# EAGLE schematic pc-001 (EAGLE 9.1.0)
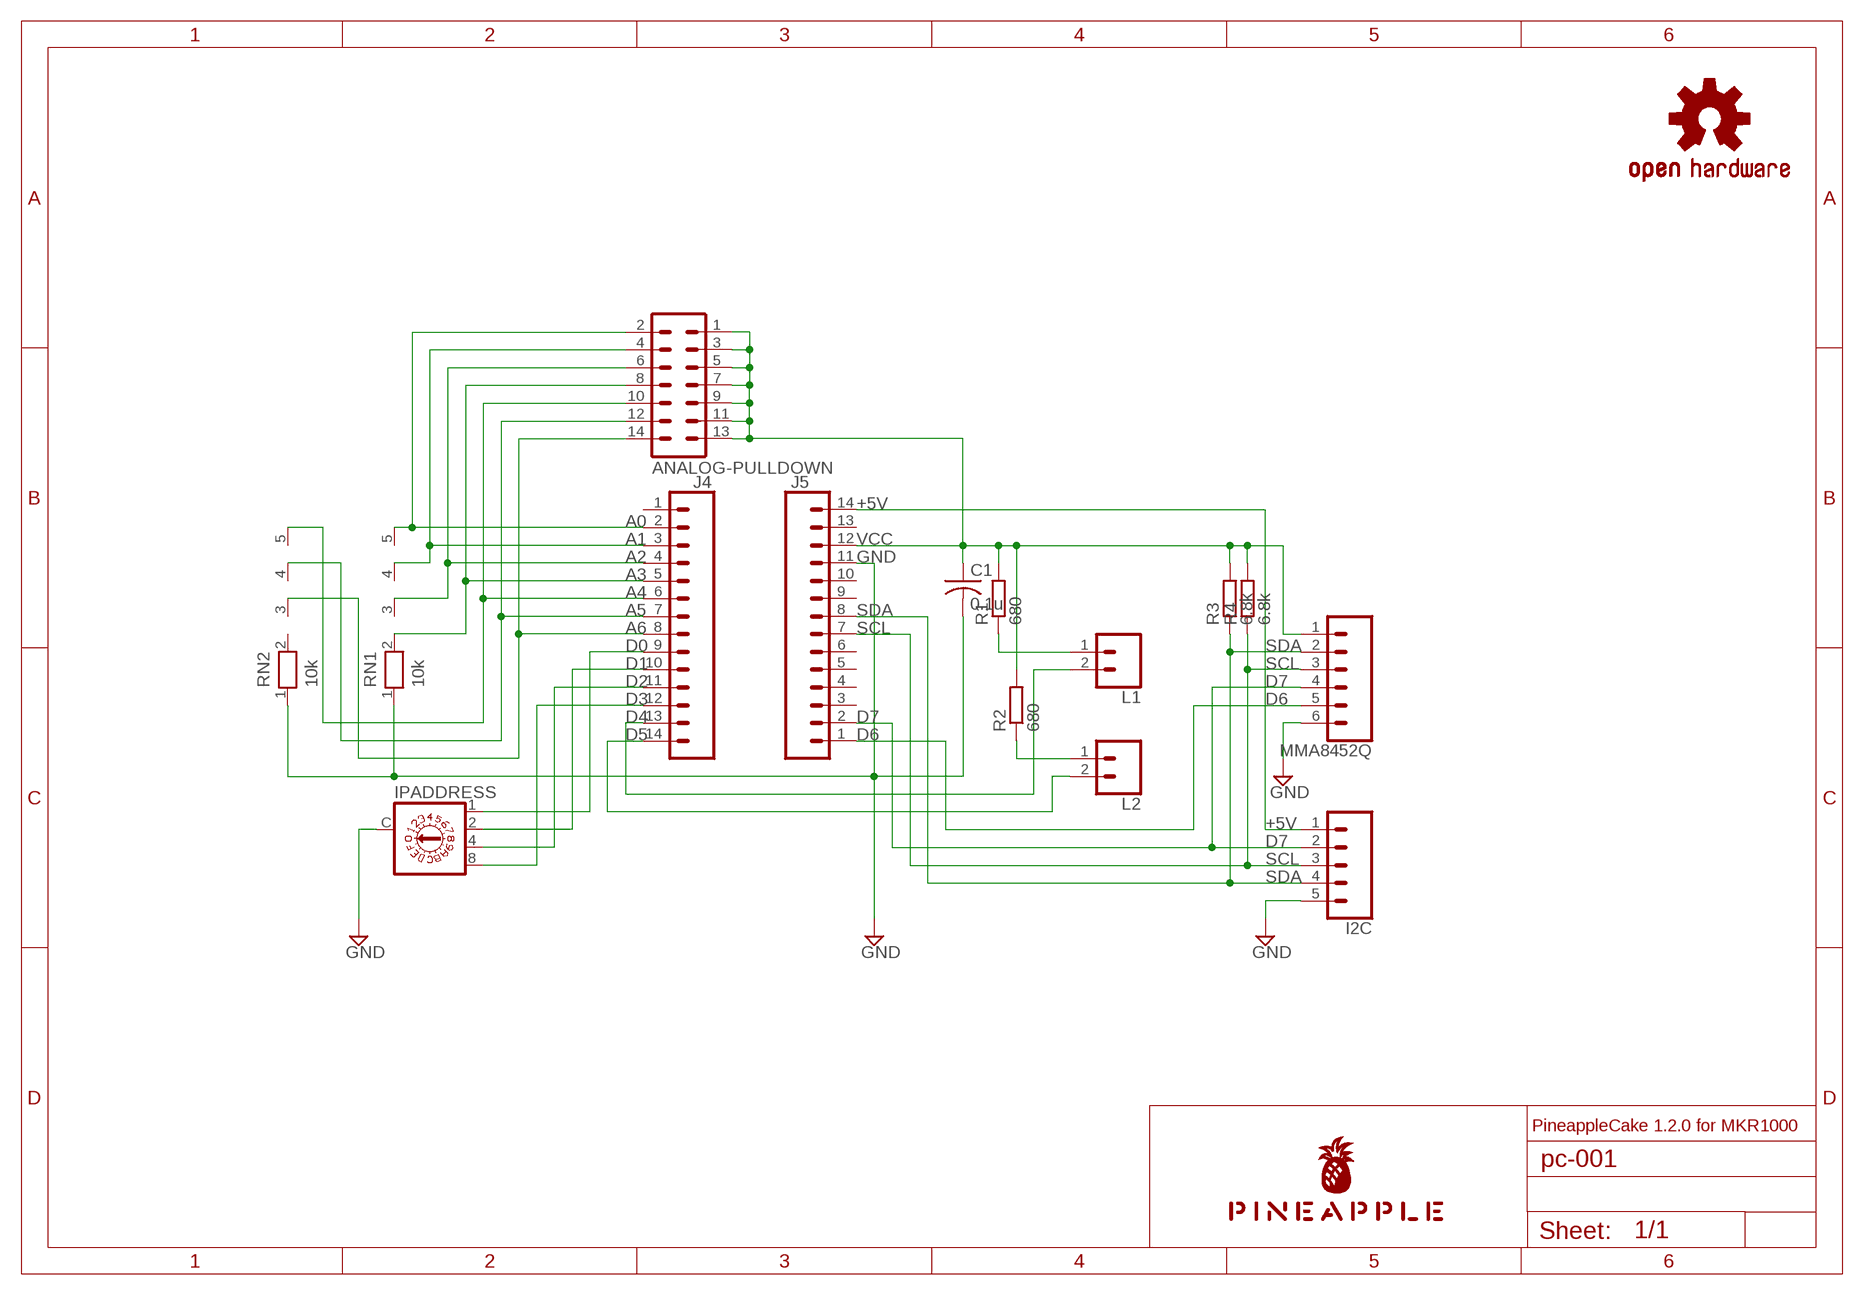
[diagram p0: schematic, sheet 1]

## Parts
ANALOG-PULLDOWN  ML14L  [ML14L]
C1  0.1u  C-US025-025X050  [C025-025X050]
I2C  CONN_05SMD  [1X05_1MM]
IPADDRESS  A1353HEX  [A1353HEX]
J4  DNP  CONN_14  [1X14]
J5  DNP  CONN_14  [1X14]
L1  CONN_02-JST-2-PTH-NO_SILK  [JST-2-PTH-NS]
L2  CONN_02-JST-2-PTH-NO_SILK  [JST-2-PTH-NS]
LOGO1  OSHW-LOGOS-COPPER  [OSHW-LOGO-S_COPPER]
MMA8452Q  CONN_06NO_SILK_FEMALE_PTH  [1X06_NO_SILK]
R1  680  R-EU_0204/5  [0204/5]
R2  680  R-EU_0204/5  [0204/5]
R3  6.8k  R-EU_0204/5  [0204/5]
R4  6.8k  R-EU_0204/5  [0204/5]
RN1  10k  RN04  [RN-5]
RN2  10k  RN04  [RN-5]
U$1  PINEAPPLE450  [PINEAPPLE450]

## Nets
+5V [power]: I2C.1 J5.14
A0: ANALOG-PULLDOWN.2 J4.2 RN1.5
A1: ANALOG-PULLDOWN.4 J4.3 RN1.4
A2: ANALOG-PULLDOWN.6 J4.4 RN1.3
A3: ANALOG-PULLDOWN.8 J4.5 RN1.2
A4: ANALOG-PULLDOWN.10 J4.6 RN2.5
A5: ANALOG-PULLDOWN.12 J4.7 RN2.4
A6: ANALOG-PULLDOWN.14 J4.8 RN2.3
D0: IPADDRESS.1 J4.9
D1: IPADDRESS.2 J4.10
D2: IPADDRESS.4 J4.11
D3: IPADDRESS.8 J4.12
D4: J4.13 L1.2
D5: J4.14 L2.2
D6: J5.1 MMA8452Q.5
D7: I2C.2 J5.2 MMA8452Q.4
GND [gnd]: C1.2 I2C.5 IPADDRESS.C J5.11 MMA8452Q.6 RN1.1 RN2.1
LED1A: L1.1 R1.1
LED2A: L2.1 R2.1
SCL: I2C.3 J5.7 MMA8452Q.3 R4.1
SDA: I2C.4 J5.8 MMA8452Q.2 R3.1
VCC [power]: ANALOG-PULLDOWN.1 ANALOG-PULLDOWN.3 ANALOG-PULLDOWN.5 ANALOG-PULLDOWN.7 ANALOG-PULLDOWN.9 ANALOG-PULLDOWN.11 ANALOG-PULLDOWN.13 C1.1 J5.12 MMA8452Q.1 R1.2 R2.2 R3.2 R4.2
Unconnected: J4.1 J5.3 J5.4 J5.5 J5.6 J5.9 J5.10 J5.13 RN2.2

## Notes on the sheet
- PineappleCake 1.2.0 for MKR1000

## Library data of the parts
ANALOG-PULLDOWN = con-ml:ML14L: HARTING; OC_FARNELL: unknown; OC_NEWARK: unknown
C1 = resistor:C-US: CAPACITOR, American symbol
I2C = SparkFun-Connectors:CONN_05: Multi connection point. Often used as Generic Header-pin footprint for 0.1 inch spaced/style header connections On any of the 0.1 inch spaced packages, you can populate with these: Break Away Headers - Straight <https://www.sparkfun.com/products/116> (PRT-00116) Break Away Male Headers - Right Angle <https://www.sparkfun.com/products/553> (PRT-00553) Female Headers <https://www.sparkfun.com/products/115> (PRT-00115) Break Away Headers - Machine Pin <https://www.sparkfun.com/products/117> (PRT-00117) Break Away Female Headers - Swiss Machine Pin <https://www.sparkfun.com/products/743> (PRT-00743) For SCREWTERMINALS and SPRING TERMINALS visit here: Screw Terimnals on SparkFun.com <https://www.sparkfun.com/search/results?term=Screw+Terminals> (5mm/3.5mm/2.54mm spacing) This device is also useful as a general connection point to wire up your design to another part of your project. Our various solder wires solder well into these plated through hole pads. Hook-Up Wire - Assortment (Stranded, 22 AWG) <https://www.sparkfun.com/products/11375> (PRT-11375) Hook-Up Wire - Assortment (Solid Core, 22 AWG) <https://www.sparkfun.com/products/11367> (PRT-11367) View the entire wire category on our website here <https://www.sparkfun.com/categories/141> Special notes: Molex polarized connector foot print use with SKU : PRT-08231 with associated crimp pins and housings. 1MM SMD Version SKU: PRT-10208; PROD_ID: CONN-08528; SF_ID: GPS-08288
IPADDRESS = switch-dil:A1353HEX: DIL/CODE SWITCH; OC_FARNELL: unknown; OC_NEWARK: unknown
J4 J5 = SparkFun-Connectors:CONN_14: Multi connection point. Often used as Generic Header-pin footprint for 0.1 inch spaced/style header connections On any of the 0.1 inch spaced packages, you can populate with these: Break Away Headers - Straight <https://www.sparkfun.com/products/116> (PRT-00116) Break Away Male Headers - Right Angle <https://www.sparkfun.com/products/553> (PRT-00553) Female Headers <https://www.sparkfun.com/products/115> (PRT-00115) Break Away Headers - Machine Pin <https://www.sparkfun.com/products/117> (PRT-00117) Break Away Female Headers - Swiss Machine Pin <https://www.sparkfun.com/products/743> (PRT-00743) For SCREWTERMINALS and SPRING TERMINALS visit here: Screw Terimnals on SparkFun.com <https://www.sparkfun.com/search/results?term=Screw+Terminals> (5mm/3.5mm/2.54mm spacing) This device is also useful as a general connection point to wire up your design to another part of your project. Our various solder wires solder well into these plated through hole pads. Hook-Up Wire - Assortment (Stranded, 22 AWG) <https://www.sparkfun.com/products/11375> (PRT-11375) Hook-Up Wire - Assortment (Solid Core, 22 AWG) <https://www.sparkfun.com/products/11367> (PRT-11367) View the entire wire category on our website here <https://www.sparkfun.com/categories/141> Special notes: Molex polarized connector foot print use with SKU : PRT-08231 with associated crimp pins and housings. 1MM SMD Version SKU: PRT-10208 NOTES ON THE VARIANTS LOCK and LOCK_LONGPADS... This footprint was designed to help hold the alignment of a through-hole component (i.e. 6-pin header) while soldering it into place. You may notice that each hole has been shifted either up or down by 0.005 of an inch from it's more standard position (which is a perfectly straight line). This slight alteration caused the pins (the squares in the middle) to touch the edges of the holes. Because they are alternating, it causes a "brace" to hold the component in place. 0.005 has proven to be the perfect amount of "off-center" position when using our standard breakaway headers. Although looks a little odd when you look at the bare footprint, once you have a header in there, the alteration is very hard to notice. Also,if you push a header all the way into place, it is covered up entirely on the bottom side.
L1 L2 = SparkFun-Connectors:CONN_02: Multi connection point. Often used as Generic Header-pin footprint for 0.1 inch spaced/style header connections On any of the 0.1 inch spaced packages, you can populate with these: Break Away Headers - Straight <https://www.sparkfun.com/products/116> (PRT-00116) Break Away Male Headers - Right Angle <https://www.sparkfun.com/products/553> (PRT-00553) Female Headers <https://www.sparkfun.com/products/115> (PRT-00115) Break Away Headers - Machine Pin <https://www.sparkfun.com/products/117> (PRT-00117) Break Away Female Headers - Swiss Machine Pin <https://www.sparkfun.com/products/743> (PRT-00743) For SCREWTERMINALS and SPRING TERMINALS visit here: Screw Terimnals on SparkFun.com <https://www.sparkfun.com/search/results?term=Screw+Terminals> (5mm/3.5mm/2.54mm spacing) This device is also useful as a general connection point to wire up your design to another part of your project. Our various solder wires solder well into these plated through hole pads. Hook-Up Wire - Assortment (Stranded, 22 AWG) <https://www.sparkfun.com/products/11375> (PRT-11375) Hook-Up Wire - Assortment (Solid Core, 22 AWG) <https://www.sparkfun.com/products/11367> (PRT-11367) View the entire wire category on our website here <https://www.sparkfun.com/categories/141> Special notes: Molex polarized connector foot print use with: PRT-08233 with associated crimp pins and housings. 2.54_SCREWTERM for use with PRT-10571. 3.5mm Screw Terminal footprints for PRT-08084 5mm Screw Terminal footprints for use with PRT-08432
LOGO1 = SparkFun-Aesthetics:OSHW-LOGO: Open-Source Hardware (OSHW) Logo This logo indicates the piece of hardware it is found on incorporates a OSHW license and/or adheres to the definition of open source hardware found here: http://freedomdefined.org/OSHW
MMA8452Q = SparkFun-Connectors:CONN_06: Multi connection point. Often used as Generic Header-pin footprint for 0.1 inch spaced/style header connections On any of the 0.1 inch spaced packages, you can populate with these: Break Away Headers - Straight <https://www.sparkfun.com/products/116> (PRT-00116) Break Away Male Headers - Right Angle <https://www.sparkfun.com/products/553> (PRT-00553) Female Headers <https://www.sparkfun.com/products/115> (PRT-00115) Break Away Headers - Machine Pin <https://www.sparkfun.com/products/117> (PRT-00117) Break Away Female Headers - Swiss Machine Pin <https://www.sparkfun.com/products/743> (PRT-00743) Arduino Stackable Header - 6 Pin <https://www.sparkfun.com/products/9280> (PRT-09280) For SCREWTERMINALS and SPRING TERMINALS visit here: Screw Terimnals on SparkFun.com <https://www.sparkfun.com/search/results?term=Screw+Terminals> (5mm/3.5mm/2.54mm spacing) This device is also useful as a general connection point to wire up your design to another part of your project. Our various solder wires solder well into these plated through hole pads. Hook-Up Wire - Assortment (Stranded, 22 AWG) <https://www.sparkfun.com/products/11375> (PRT-11375) Hook-Up Wire - Assortment (Solid Core, 22 AWG) <https://www.sparkfun.com/products/11367> (PRT-11367) View the entire wire category on our website here <https://www.sparkfun.com/categories/141>; PROD_ID: CONN-08437
R1-R4 = resistor:R-EU_: RESISTOR, European symbol
RN1 RN2 = resistor-net:RN04: RESISTOR NETWORK; OC_FARNELL: unknown; OC_NEWARK: unknown
U$1 = pineapple:PINEAPPLE450

## Net classes
0 default: width 0.152 mm, drill 0.152 mm, clearance 0.152 mm
1 gnd: width 0.305 mm, drill 0.152 mm, clearance 0.152 mm
2 power: width 0.61 mm, drill 0.152 mm, clearance 0.152 mm